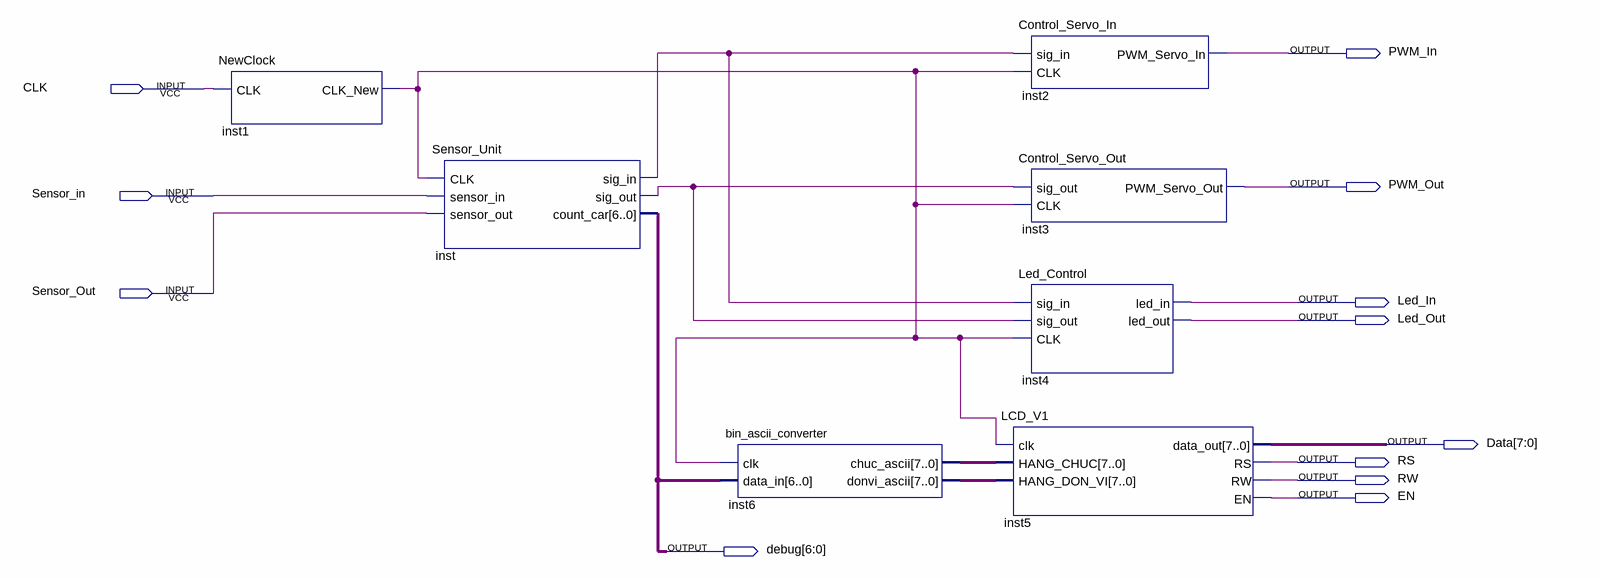
[diagram p0: schematic sheet]
// Quartus schematic systemfinal.bdf as structural Verilog: 7 symbols, 12 pins
module systemfinal (
  input  CLK,
  input  Sensor_in,
  input  Sensor_Out,
  output PWM_In,
  output PWM_Out,
  output Led_In,
  output Led_Out,
  output [7:0] Data,
  output RS,
  output RW,
  output EN,
  output [6:0] debug
);

  wire inst1_clk_new, inst_sig_in, inst_sig_out;
  wire [7:0] inst6_chuc_ascii, inst6_donvi_ascii;

  NewClock inst1 (.CLK(CLK), .CLK_New(inst1_clk_new));
  Sensor_Unit inst (
    .CLK(inst1_clk_new), .sensor_in(Sensor_in), .sensor_out(Sensor_Out), .sig_in(inst_sig_in),
    .sig_out(inst_sig_out), .count_car(debug));
  bin_ascii_converter inst6 (
    .clk(inst1_clk_new), .data_in(debug), .chuc_ascii(inst6_chuc_ascii), .donvi_ascii(inst6_donvi_ascii));
  Control_Servo_In inst2 (.sig_in(inst_sig_in), .CLK(inst1_clk_new), .PWM_Servo_In(PWM_In));
  Control_Servo_Out inst3 (.sig_out(inst_sig_out), .CLK(inst1_clk_new), .PWM_Servo_Out(PWM_Out));
  Led_Control inst4 (
    .sig_in(inst_sig_in), .sig_out(inst_sig_out), .CLK(inst1_clk_new), .led_in(Led_In), .led_out(Led_Out));
  LCD_V1 inst5 (
    .clk(inst1_clk_new), .HANG_CHUC(inst6_chuc_ascii), .HANG_DON_VI(inst6_donvi_ascii), .data_out(Data),
    .RS(RS), .RW(RW), .EN(EN));
endmodule
